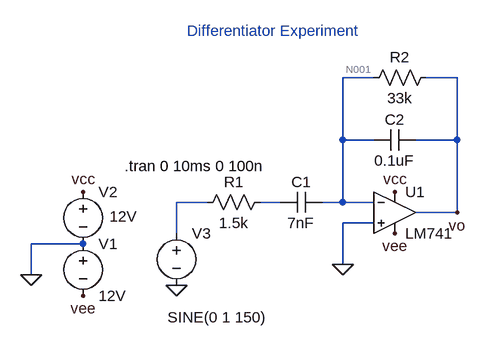
[diagram p0: schematic Opampdifferentiator.asc]
Opampdifferentiator.asc, the LTspice schematic file:
Version 4.1
SHEET 1 880 680
WIRE 288 -112 240 -112
WIRE 416 -112 368 -112
WIRE 240 -16 240 -112
WIRE 288 -16 240 -16
WIRE 416 -16 416 -112
WIRE 416 -16 352 -16
WIRE 32 80 -16 80
WIRE 144 80 112 80
WIRE 240 80 240 -16
WIRE 240 80 208 80
WIRE 288 80 240 80
WIRE 416 96 416 -16
WIRE 416 96 352 96
WIRE 288 112 240 112
WIRE -16 128 -16 80
WIRE -160 144 -240 144
WIRE 240 176 240 112
WIRE -240 192 -240 144
FLAG -240 192 0
FLAG -160 64 vcc
FLAG -160 224 vee
FLAG 320 64 vcc
FLAG 320 128 vee
FLAG 240 176 0
FLAG -16 208 0
FLAG 416 96 vo
SYMBOL voltage -160 128 R0
WINDOW 123 0 0 Left 0
WINDOW 39 0 0 Left 0
SYMATTR InstName V1
SYMATTR Value 12V
SYMBOL voltage -160 48 R0
WINDOW 3 41 54 Left 2
WINDOW 123 0 0 Left 0
WINDOW 39 0 0 Left 0
SYMATTR Value 12V
SYMATTR InstName V2
SYMBOL LM741 320 32 R0
SYMATTR InstName U1
SYMBOL voltage -16 112 R0
WINDOW 123 24 124 Left 2
WINDOW 39 0 0 Left 0
WINDOW 3 -14 145 Left 2
SYMATTR InstName V3
SYMATTR Value SINE(0 1 150)
SYMBOL res 128 64 R90
WINDOW 0 0 56 VBottom 2
WINDOW 3 32 56 VTop 2
SYMATTR InstName R1
SYMATTR Value 1.5k
SYMBOL cap 208 64 R90
WINDOW 0 0 32 VBottom 2
WINDOW 3 32 32 VTop 2
SYMATTR InstName C1
SYMATTR Value 7nF
SYMBOL res 384 -128 R90
WINDOW 0 0 56 VBottom 2
WINDOW 3 32 56 VTop 2
SYMATTR InstName R2
SYMATTR Value 33k
SYMBOL cap 352 -32 R90
WINDOW 0 0 32 VBottom 2
WINDOW 3 32 32 VTop 2
SYMATTR InstName C2
SYMATTR Value 0.1uF
TEXT 0 -184 Left 2 ;Differentiator Experiment
TEXT -96 24 Left 2 !.tran 0 10ms 0 100n

The netlist it stands for:
* Opampdifferentiator.asc
V1 0 vee 12V
V2 vcc 0 12V
X§U1 0 N001 vcc vee vo LM741  ; pins In+ In- V+ V- OUT
V3 N002 0 SINE(0 1 150)
R1 N003 N002 1.5k
C1 N001 N003 7nF
R2 vo N001 33k
C2 vo N001 0.1uF
* Differentiator Experiment
.tran 0 10ms 0 100n
.lib LM741.lib
.backanno
.end

* Results of the author's LTspice run, read from the files saved beside the schematic
* Operating Point, zero values left out:
*   V(vcc) = 12 V
*   V(vo) = 4.361 mV
*   V(vee) = -12 V
*   V(n001) = 1 mV
*   I(V1) = -1.626 mA
*   I(R2) = 101.9 nA
*   I(V2) = -1.626 mA
*   Ix(u1:1) = 57.86 nA
*   Ix(u1:2) = 101.9 nA
*   Ix(u1:99) = 1.626 mA
*   Ix(u1:50) = -1.626 mA
*   Ix(u1:28) = -101.9 nA